# EAGLE design ee40 (EAGLE 6.5.0)
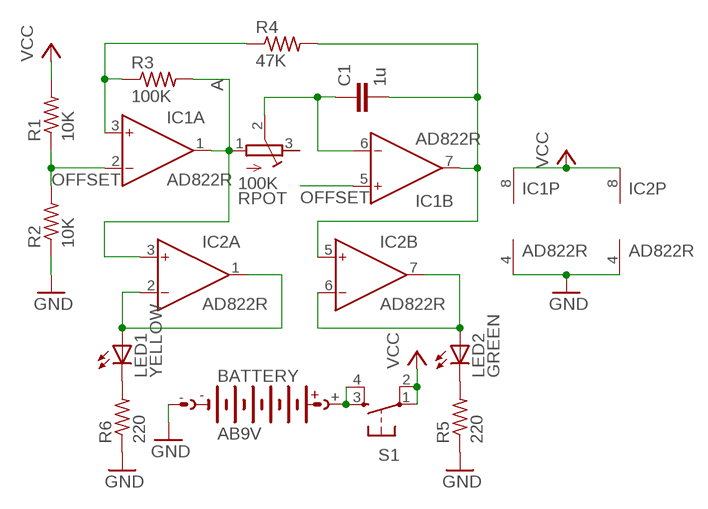
[diagram p0: schematic, sheet 1]

## Parts
BATTERY  AB9V  [AB9V]
C1  1u  CAP0805  [0805]
IC1  AD822R  [SO8]
IC2  AD822R  [SO8]
LED1  YELLOW  LED3MM  [LED3MM]
LED2  GREEN  LED3MM  [LED3MM]
R1  10K  R-US_R0603  [R0603]
R2  10K  R-US_R0603  [R0603]
R3  100K  R-US_R0603  [R0603]
R4  47K  R-US_R0603  [R0603]
R5  220  R-US_R0603  [R0603]
R6  220  R-US_R0603  [R0603]
RPOT  100K  R-TRIMM5X  [RTRIM5X]
S1  TAC_SWITCHPTH  [TACTILE-PTH]

## Nets
A: IC1.1(A:OUT) IC2.3(A:IN+) R3.2 RPOT.1(E)
B: IC2.6(B:IN-) IC2.7(B:OUT) LED2.A
GND: BATTERY.- IC1.4(P:V-) IC2.4(P:V-) R2.1 R5.1 R6.1
N$1: BATTERY.+ S1.3 S1.4
N$2: C1.1 IC1.6(B:IN-) RPOT.2(S)
N$5: C1.2 IC1.7(B:OUT) IC2.5(B:IN+) R4.2
N$6: IC1.3(A:IN+) R3.1 R4.1
N$7: IC2.1(A:OUT) IC2.2(A:IN-) LED1.A
N$8: LED1.K(C) R6.2
N$10: LED2.K(C) R5.2
OFFSET: IC1.2(A:IN-) IC1.5(B:IN+) R1.1 R2.2
VCC: IC1.8(P:V+) IC2.8(P:V+) R1.2 S1.1 S1.2
Unconnected: RPOT.3(A)

## Library data of the parts
BATTERY = battery:AB9V: 9-V BATTERY CLIP
C1 = pie:CAP: Capacitor Standard 0603 ceramic capacitor, and 0.1" leaded capacitor.; PIE-INT-REF-NUM: CAPACITOR-GENERIC
IC1 IC2 = analog-devices:AD822: Single-Supply, Rail-to-Rail Low Power FET-Input Op Amp Source: http://www.analog.com/static/imported-files/data_sheets/AD822.pdf; MF: ANALOG DEVICES; MPN: AD822BRZ; OC_FARNELL: 1651303
LED1 LED2 = led:LED: LED OSRAM: - CHIPLED LG R971, LG N971, LY N971, LG Q971, LY Q971, LO R971, LY R971 LH N974, LH R974 LS Q976, LO Q976, LY Q976 LO Q996 - Hyper CHIPLED LW Q18S LB Q993, LB Q99A, LB R99A - SideLED LS A670, LO A670, LY A670, LG A670, LP A670 LB A673, LV A673, LT A673, LW A673 LH A674 LY A675 LS A676, LA A676, LO A676, LY A676, LW A676 LS A679, LY A679, LG A679 - Hyper Micro SIDELED® LS Y876, LA Y876, LO Y876, LY Y876 LT Y87S - SmartLED LW L88C, LW L88S LB L89C, LB L89S, LG L890 LS L89K, LO L89K, LY L89K LS L896, LA L896, LO L896, LY L896 - TOPLED LS T670, LO T670, LY T670, LG T670, LP T670 LSG T670, LSP T670, LSY T670, LOP T670, LYG T670 LG T671, LOG T671, LSG T671 LB T673, LV T673, LT T673, LW T673 LH T674 LS T676, LA T676, LO T676, LY T676, LB T676, LH T676, LSB T676, LW T676 LB T67C, LV T67C, LT T67C, LS T67K, LO T67K, LY T67K, LW E67C LS E67B, LA E67B, LO E67B, LY E67B, LB E67C, LV E67C, LT E67C LW T67C LS T679, LY T679, LG T679 LS T770, LO T770, LY T770, LG T770, LP T770 LB T773, LV T773, LT T773, LW T773 LH T774 LS E675, LA E675, LY E675, LS T675 LS T776, LA T776, LO T776, LY T776, LB T776 LHGB T686 LT T68C, LB T68C - Hyper Mini TOPLED® LB M676 - Mini TOPLED Santana® LG M470 LS M47K, LO M47K, LY M47K Source: http://www.osram.convergy.de LUXEON: - LUMILED® LXK2-PW12-R00, LXK2-PW12-S00, LXK2-PW14-U00, LXK2-PW14-V00 LXK2-PM12-R00, LXK2-PM12-S00, LXK2-PM14-U00 LXK2-PE12-Q00, LXK2-PE12-R00, LXK2-PE12-S00, LXK2-PE14-T00, LXK2-PE14-U00 LXK2-PB12-K00, LXK2-PB12-L00, LXK2-PB12-M00, LXK2-PB14-N00, LXK2-PB14-P00, LXK2-PB14-Q00 LXK2-PR12-L00, LXK2-PR12-M00, LXK2-PR14-Q00, LXK2-PR14-R00 LXK2-PD12-Q00, LXK2-PD12-R00, LXK2-PD12-S00 LXK2-PH12-R00, LXK2-PH12-S00 LXK2-PL12-P00, LXK2-PL12-Q00, LXK2-PL12-R00 Source: www.luxeon.com KINGBRIGHT: KA-3528ASYC Source: www.kingbright.com
R1-R6 = pie:R-US_: RESISTOR, American symbol; PIE-INT-REF-NUM: RESISTOR-GENERIC
RPOT = resistor:R-TRIMM: Trimm resistor
S1 = pie:TAC_SWITCH: Momentary Switch Button commonly used for reset or general input. Spark Fun Electronics SKU : COM-00097; PIE-INT-REF-NUM: pth_pushbutton

## Board
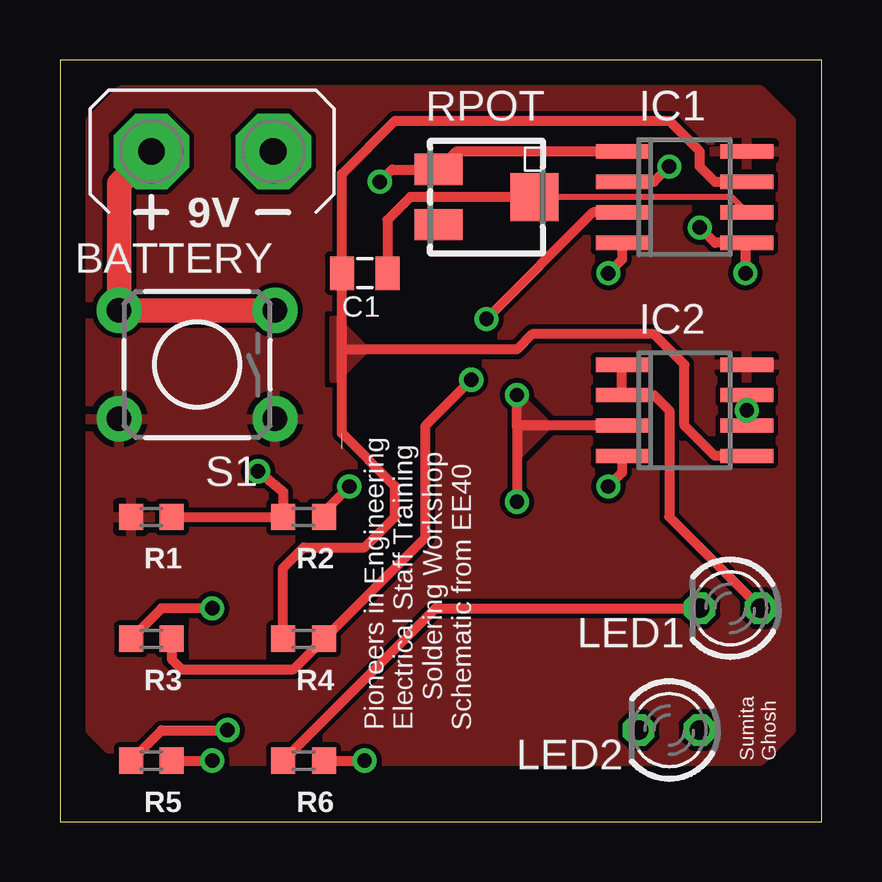
[diagram p1: board, top side]
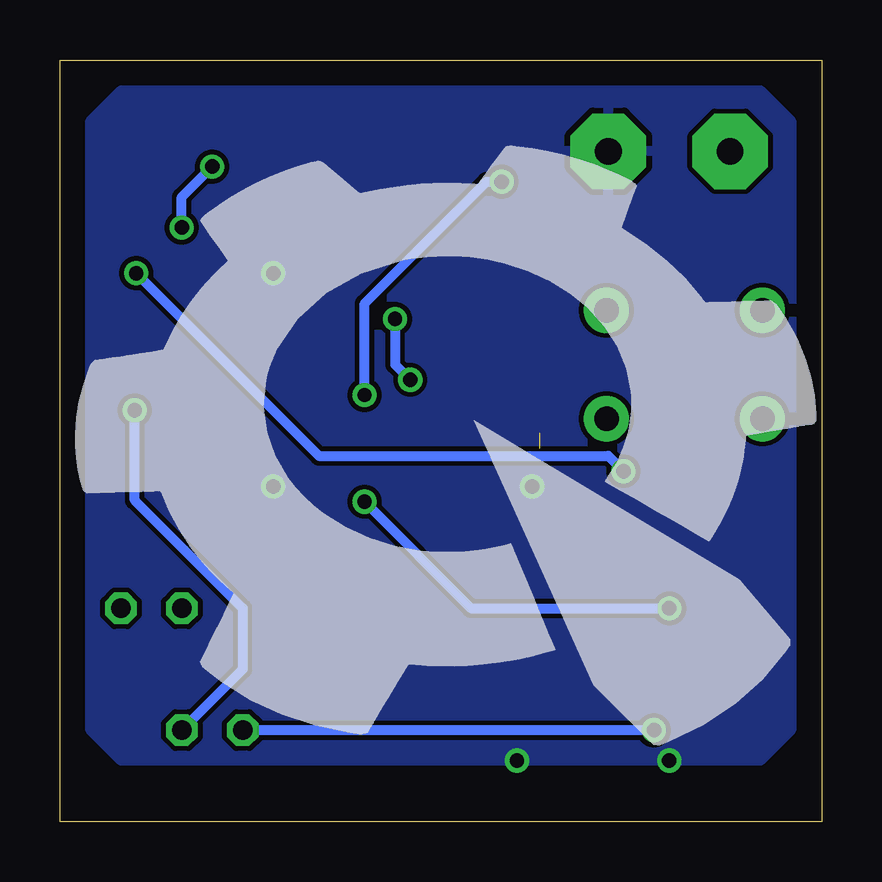
[diagram p2: board, bottom side, seen from below]

Size 31.75 x 31.75 mm. Coordinates in mm from the lower left corner, seen from the top.
Outline: 0,0 31.75,0 31.75,31.75 0,31.75 0,0
Copper layers (1*16): Top 0.035mm / dielectric 1.5mm / Bottom 0.035mm
Design rules "default": minimum track width 10mil, minimum drill 24mil, track to track 8mil, track to pad 8mil, pad to pad 8mil, via to via 8mil, smd to smd 8mil, copper to edge 40mil, drill to drill 8mil, minimum pad ring 10mil, minimum via ring 8mil, stop-mask expansion 4mil, vias tented up to drill 0mil, thermal gap 10mil

### Footprints (pad centres in the part's own frame; a part is rotated, then mirrored left to right if it is on the bottom)
AB9V = drill 1.118 pad 3.15 octagon: + 0,2.54; - 0,-2.54
0805 = smd 1 x 1.4: 1 -0.95,0; 2 0.95,0
SO8 = smd 0.6 x 2.2: 1 -1.905,-2.6; 2 -0.635,-2.6; 3 0.635,-2.6; 4 1.905,-2.6; 5 1.905,2.6; 6 0.635,2.6; 7 -0.635,2.6; 8 -1.905,2.6
LED3MM = drill 0.813 octagon: A -1.27,0; K 1.27,0
R0603 = smd 1 x 1.1: 1 -0.85,0; 2 0.85,0
RTRIM5X = smd 1.3 x 2: 1 -1.15,-2; 3 1.15,-2 | smd 2 x 2: 2 0,2
TACTILE-PTH = drill 1.016 pad 1.88: 1 -3.251,2.261; 2 3.251,2.261; 3 -3.251,-2.261; 4 3.251,-2.261

### Placement (x,y rotation side)
BATTERY  6.35,27.94 90 top
C1  12.7,22.86 180 top
IC1  26.04,26.04 270 top
IC2  26.04,17.14 270 top
LED1  27.94,8.89 180 top
LED2  25.4,3.81 180 top
R1  3.81,12.7 180 top
R2  10.16,12.7 180 top
R3  3.81,7.62 180 top
R4  10.16,7.62 180 top
R5  3.81,2.54 180 top
R6  10.16,2.54 180 top
RPOT  17.78,26.04 270 top
S1  5.71,19.05 180 top
U$1  [PIE-LOGO]  14.61,16.51 0 bottom

### Tracks (layer width: path | path; a pad name or v marks a point on that pad's centre or on a via)
A  (via drill 0.6)
  Top 0.406: IC1.1 16.54,27.94 RPOT.1 13.85,27.18 v13.34,26.67 | IC2.3 19.05,16.51 | 19.05,16.51 v19.05,17.78 | 19.05,16.51 v19.05,13.34 | v6.35,8.89 4.23,8.89 R3.2
  Bottom 0.406: v19.05,13.34 14.61,8.89 v6.35,8.89 | v19.05,17.78 19.05,21.59 13.97,26.67 v13.34,26.67
  pour Top: 19.05,15.24 20.32,16.51 19.05,17.78
B  (via drill 0.6)
  Top 0.406: IC2.7 v28.64,17.14 IC2.6
  Bottom 0.406: v28.64,17.14 28.64,13.39 24.13,8.89 24.13,6.35 LED2.A
GND  (via drill 0.6)
  Top 0.406: R5.1 v6.35,2.54 | R6.1 v12.7,2.54 | R2.1 11.01,12.91 v12.06,13.97 | IC1.4 23.43,23.43 v22.86,22.86 | IC2.4 23.43,14.54 v22.86,13.97
  pour Bottom (rank 2): 1.27,3.81 2.54,2.54 29.21,2.54 30.48,3.81 30.48,29.21 29.21,30.48 2.54,30.48 1.27,29.21
N$1
  Top 1.016: BATTERY.+ 2.46,26.59 S1.4 S1.3
N$2
  Top 0.254: IC1.6 28,26.04 RPOT.2
  Top 0.406: RPOT.2 14.61,26.04 13.65,25.08 C1.1
N$5  (1 unrouted)
  Top 0.406: IC1.7 27.3,26.67 26.67,27.3 26.67,27.94 25.4,29.21 13.97,29.21 11.75,26.99 C1.2 11.75,19.68 | R4.2 9.31,10.58 10.16,11.43 12.7,11.43 13.97,12.7 13.97,13.97 11.75,16.19 11.75,19.68 | IC2.5 27.3,15.24 26.04,16.51 26.04,19.05 24.77,20.32 19.68,20.32 19.05,19.68 11.75,19.68
  pour Top: 12.7,19.68 11.43,20.95 11.43,18.41
N$6  (via drill 0.6)
  Top 0.406: R3.1 4.66,6.77 5.08,6.35 9.74,6.35 R4.1 15.24,11.85 15.24,16.51 v17.14,18.41 | IC1.3 22.23,25.4 v17.78,20.95
  Bottom 0.406: v17.78,20.95 17.78,19.05 v17.14,18.41
N$7
  Top 0.406: IC2.1 IC2.2 24.77,17.78 25.4,17.14 25.4,12.7 LED1.A
N$8
  Top 0.406: R6.2 15.66,8.89 LED1.K
N$10  (via drill 0.6)
  Top 0.406: R5.2 4.23,3.81 v6.99,3.81
  Bottom 0.406: v6.99,3.81 LED2.K
OFFSET  (via drill 0.6)
  Top 0.406: IC1.5 28.57,24.13 | 28.57,24.13 27.3,24.13 v26.67,24.77 | IC1.2 24.77,26.67 v25.4,27.3 | R1.1 R2.2 9.31,13.76 v8.26,14.61 | 28.57,24.13 v28.57,22.86
  Bottom 0.406: v26.67,24.77 26.67,26.04 v25.4,27.3 | v28.57,22.86 20.95,15.24 8.89,15.24 v8.26,14.61
VCC
  pour Top (rank 2): 1.27,3.81 2.54,2.54 29.21,2.54 30.48,3.81 30.48,29.21 29.21,30.48 2.54,30.48 1.27,29.21

### Text on the board
tPlace: Pioneers in Engineering / Electrical Staff Training / Soldering Workshop / Schematic from EE40 | Sumita / Ghosh